# EAGLE design Ambiente_inferior (EAGLE 7.6.0)
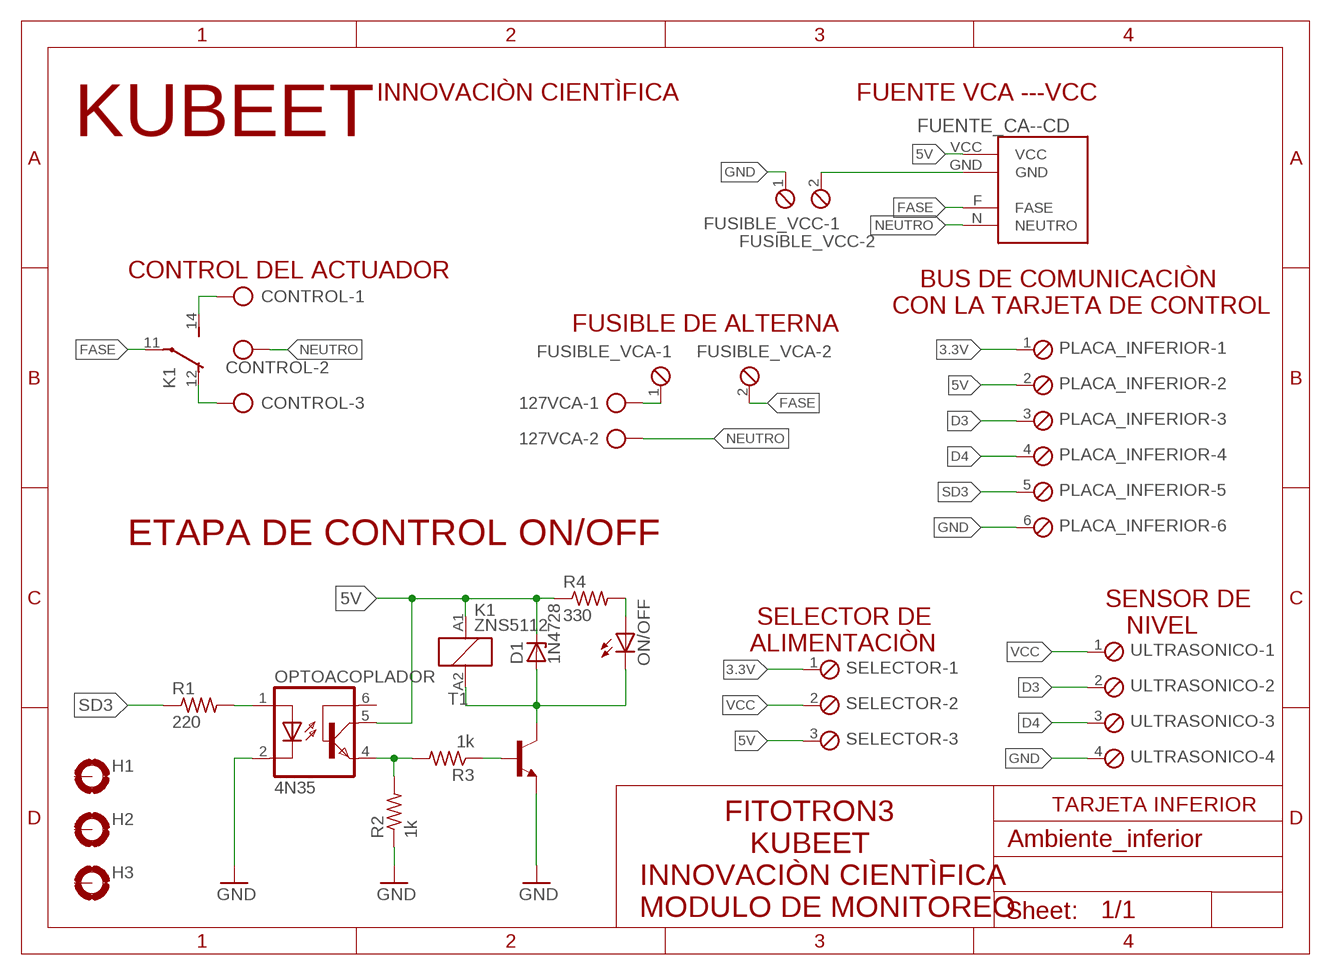
[diagram p0: schematic, sheet 1]

## Parts
127VCA  AK300/2  [AK300/2]
CONTROL  AK300/3  [AK300/3]
D1  1N4728  [DO41Z10]
FUENTE_CA--CD  MINI-FUENTE  [MINI-FUENTE]
FUSIBLE_VCA  MPT2  [2POL254]
FUSIBLE_VCC  MPT2  [2POL254]
H1  MOUNT-PAD-ROUND3.6  [3,6-PAD]
H2  MOUNT-PAD-ROUND3.6  [3,6-PAD]
H3  MOUNT-PAD-ROUND3.6  [3,6-PAD]
K1  ZNS5112  [ZN5]
ON/OFF  LED5MM  [LED5MM]
OPTOACOPLADOR  4N35  4N25M  [DIL06]
PLACA_INFERIOR  MPT6  [6POL254]
R1  220  R-US_0207/7  [0207/7]
R2  1k  R-US_0207/7  [0207/7]
R3  1k  R-US_0207/7  [0207/7]
R4  330  R-US_0207/7  [0207/7]
SELECTOR  MPT3  [3POL254]
T1  2N2222-NPN-TO92-EBC  [TO92-EBC]
ULTRASONICO  MPT4  [4POL254]

## Nets
3.3V: PLACA_INFERIOR.1 SELECTOR.1
5V: D1.C FUENTE_CA--CD.VCC K1.A1 OPTOACOPLADOR.5(COL) PLACA_INFERIOR.2 R4.1 SELECTOR.3
D3: PLACA_INFERIOR.3 ULTRASONICO.2
D4: PLACA_INFERIOR.4 ULTRASONICO.3
FASE: FUENTE_CA--CD.F(FASE) FUSIBLE_VCA.2 K1.11(2:P)
GND: FUSIBLE_VCC.1 OPTOACOPLADOR.2(C) PLACA_INFERIOR.6 R2.1 T1.E ULTRASONICO.4
N$142: OPTOACOPLADOR.1(A) R1.2
N$150: D1.A K1.A2 ON/OFF.K(C) T1.C
N$151: OPTOACOPLADOR.4(EMI) R2.2 R3.2
N$152: CONTROL.1 K1.14(2:S)
N$153: CONTROL.3 K1.12(2:O)
N$154: 127VCA.1 FUSIBLE_VCA.1
N$155: R3.1 T1.B
N$156: ON/OFF.A R4.2
N$166: FUENTE_CA--CD.GND FUSIBLE_VCC.2
NEUTRO: 127VCA.2 CONTROL.2 FUENTE_CA--CD.N(NEUTRO)
SD3: PLACA_INFERIOR.5 R1.1
VCC: SELECTOR.2 ULTRASONICO.1
Unconnected: H1.B3,6(MOUNT) H2.B3,6(MOUNT) H3.B3,6(MOUNT) OPTOACOPLADOR.6(BAS)

## Notes on the sheet
- INNOVACIÒN CIENTÌFICA | FUENTE VCA ---VCC
- KUBEET
- CONTROL DEL ACTUADOR
- BUS DE COMUNICACIÒN 
  CON LA TARJETA DE CONTROL
- FUSIBLE DE ALTERNA
- ETAPA DE CONTROL ON/OFF
- SENSOR DE
     NIVEL
- SELECTOR DE
  ALIMENTACIÒN
- TARJETA INFERIOR
- FITOTRON3
               KUBEET 
  INNOVACIÒN CIENTÌFICA
  MODULO DE MONITOREO

## Library data of the parts
127VCA = con-ptr500:AK300/2: CONNECTOR; OC_FARNELL: unknown; OC_NEWARK: unknown
CONTROL = con-ptr500:AK300/3: CONNECTOR; OC_FARNELL: unknown; OC_NEWARK: unknown
D1 = diode:1N4728: Z DIODE 3.3 V, 1W, 5 percent
FUENTE_CA--CD = CONECTORES RODAS:MINI-FUENTE
FUSIBLE_VCA FUSIBLE_VCC = con-phoenix-254:MPT2: PHOENIX CONNECTOR; OC_FARNELL: unknown; OC_NEWARK: unknown
H1-H3 = holes:MOUNT-PAD-ROUND: MOUNTING PAD, round
K1 = relay:ZNS5*: Miniature Power PCB Relay SCHRACK 1pole 10 A Source: http://www.schrack.com/.. 5847.pdf; OC_FARNELL: unknown; OC_NEWARK: unknown
ON/OFF = led:LED: LED OSRAM: - CHIPLED LG R971, LG N971, LY N971, LG Q971, LY Q971, LO R971, LY R971 LH N974, LH R974 LS Q976, LO Q976, LY Q976 LO Q996 - Hyper CHIPLED LW Q18S LB Q993, LB Q99A, LB R99A - SideLED LS A670, LO A670, LY A670, LG A670, LP A670 LB A673, LV A673, LT A673, LW A673 LH A674 LY A675 LS A676, LA A676, LO A676, LY A676, LW A676 LS A679, LY A679, LG A679 - Hyper Micro SIDELED® LS Y876, LA Y876, LO Y876, LY Y876 LT Y87S - SmartLED LW L88C, LW L88S LB L89C, LB L89S, LG L890 LS L89K, LO L89K, LY L89K LS L896, LA L896, LO L896, LY L896 - TOPLED LS T670, LO T670, LY T670, LG T670, LP T670 LSG T670, LSP T670, LSY T670, LOP T670, LYG T670 LG T671, LOG T671, LSG T671 LB T673, LV T673, LT T673, LW T673 LH T674 LS T676, LA T676, LO T676, LY T676, LB T676, LH T676, LSB T676, LW T676 LB T67C, LV T67C, LT T67C, LS T67K, LO T67K, LY T67K, LW E67C LS E67B, LA E67B, LO E67B, LY E67B, LB E67C, LV E67C, LT E67C LW T67C LS T679, LY T679, LG T679 LS T770, LO T770, LY T770, LG T770, LP T770 LB T773, LV T773, LT T773, LW T773 LH T774 LS E675, LA E675, LY E675, LS T675 LS T776, LA T776, LO T776, LY T776, LB T776 LHGB T686 LT T68C, LB T68C - Hyper Mini TOPLED® LB M676 - Mini TOPLED Santana® LG M470 LS M47K, LO M47K, LY M47K Source: http://www.osram.convergy.de LUXEON: - LUMILED® LXK2-PW12-R00, LXK2-PW12-S00, LXK2-PW14-U00, LXK2-PW14-V00 LXK2-PM12-R00, LXK2-PM12-S00, LXK2-PM14-U00 LXK2-PE12-Q00, LXK2-PE12-R00, LXK2-PE12-S00, LXK2-PE14-T00, LXK2-PE14-U00 LXK2-PB12-K00, LXK2-PB12-L00, LXK2-PB12-M00, LXK2-PB14-N00, LXK2-PB14-P00, LXK2-PB14-Q00 LXK2-PR12-L00, LXK2-PR12-M00, LXK2-PR14-Q00, LXK2-PR14-R00 LXK2-PD12-Q00, LXK2-PD12-R00, LXK2-PD12-S00 LXK2-PH12-R00, LXK2-PH12-S00 LXK2-PL12-P00, LXK2-PL12-Q00, LXK2-PL12-R00 Source: www.luxeon.com KINGBRIGHT: KA-3528ASYC Source: www.kingbright.com
OPTOACOPLADOR = optocoupler:4N*?M: General Purpose 6-Pin Phototransistor Optocouplers Source: http://www.fairchildsemi.com/ds/4N/4N35-M.pdf; MPN: 4N25-M; OC_FARNELL: 1021349; OC_NEWARK: 98K9084
PLACA_INFERIOR = con-phoenix-254:MPT6: PHOENIX CONNECTOR; OC_FARNELL: unknown; OC_NEWARK: unknown
R1-R4 = rcl:R-US_: RESISTOR, American symbol
SELECTOR = con-phoenix-254:MPT3: PHOENIX CONNECTOR; OC_FARNELL: unknown; OC_NEWARK: unknown
T1 = transistor-neu-to92:*-NPN-: NPN Transistror
ULTRASONICO = con-phoenix-254:MPT4: PHOENIX CONNECTOR; OC_FARNELL: unknown; OC_NEWARK: unknown

## Board
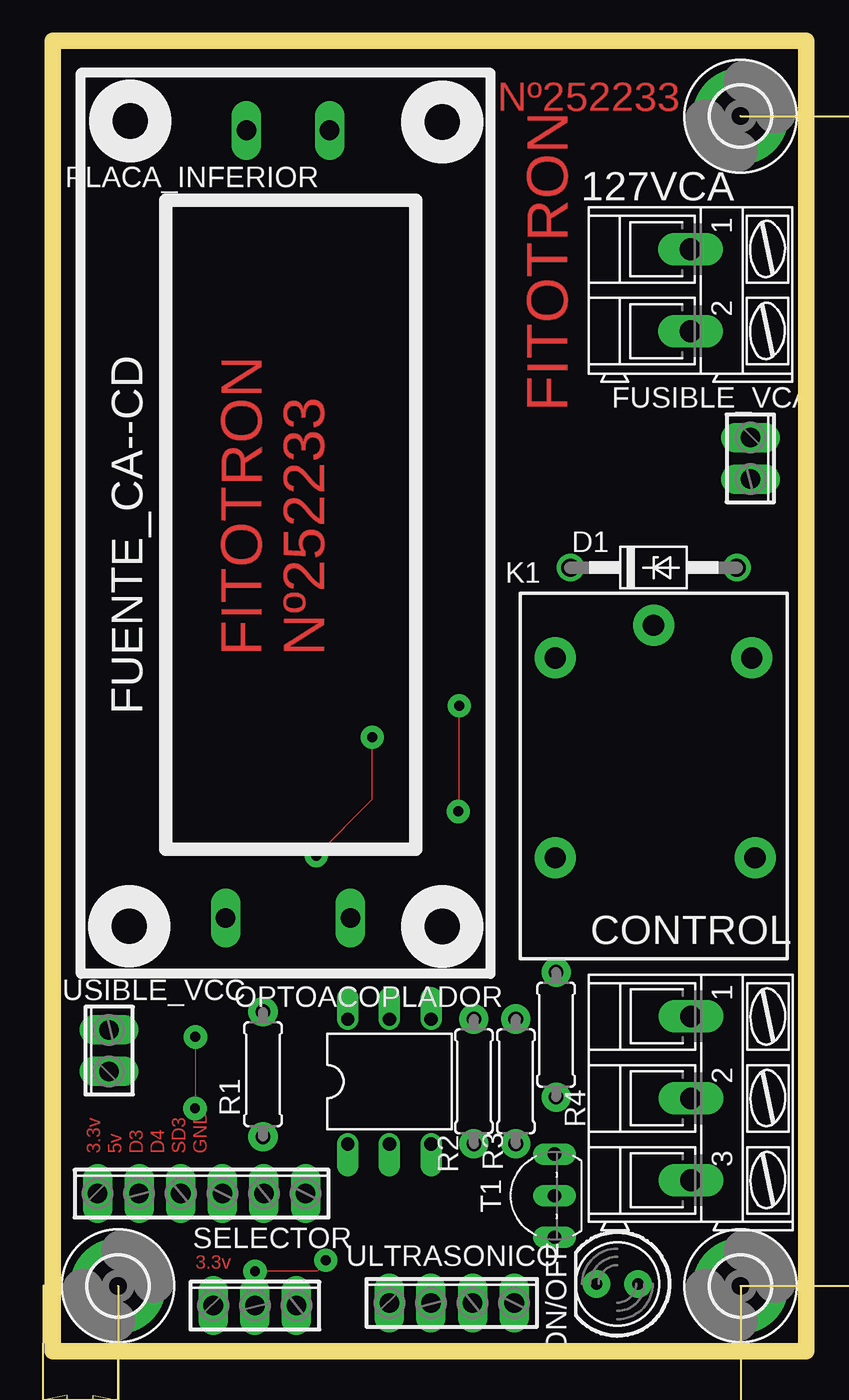
[diagram p1: board, top side]
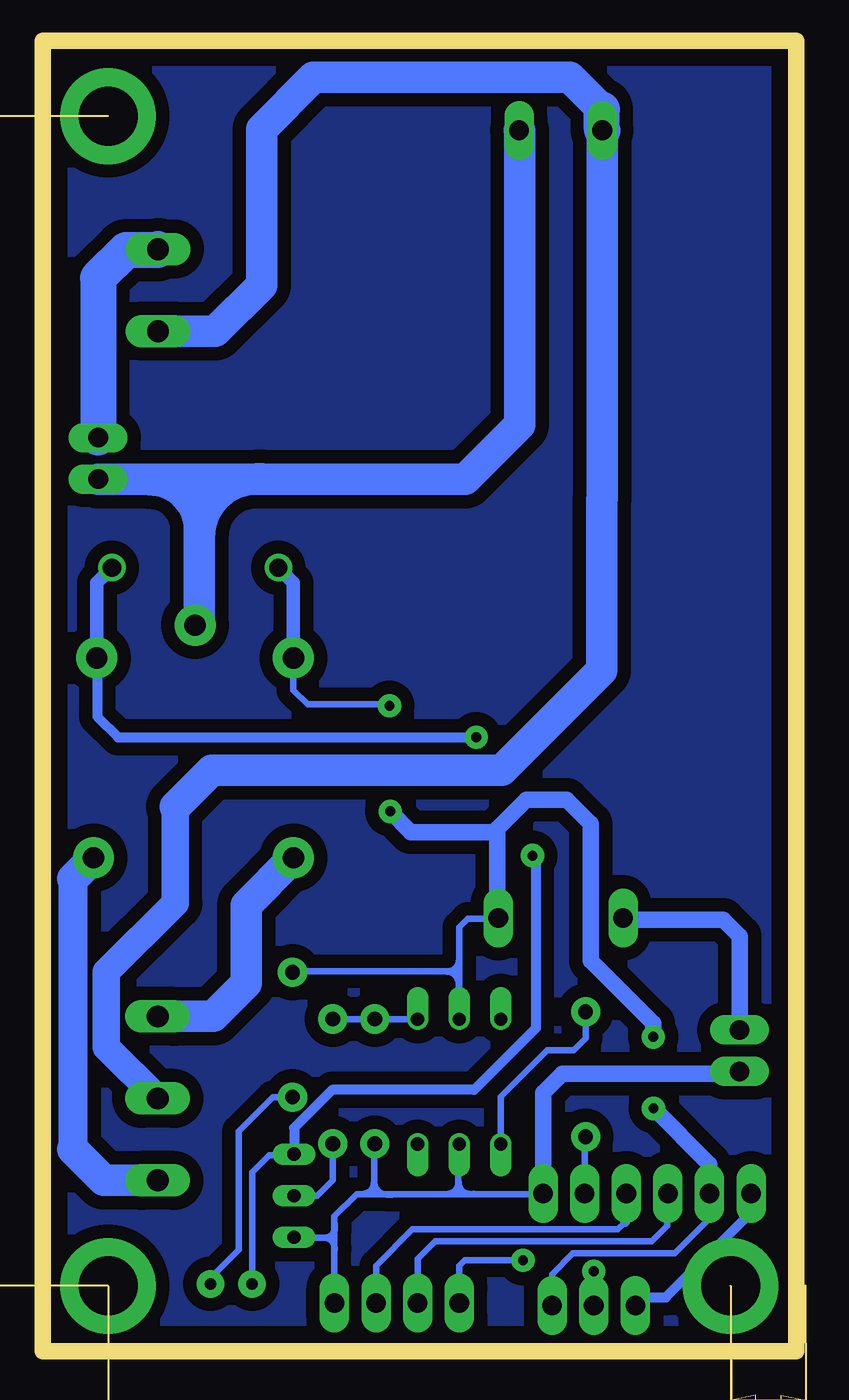
[diagram p2: board, bottom side, seen from below]

Size 46 x 80 mm. Coordinates in mm from the lower left corner, seen from the top.
Outline: 0,0 46,0 46,80 0,80 0,0
Copper layers (1*16): Top 0.035mm / dielectric 1.5mm / Bottom 0.035mm
Design rules "default": minimum track width 10mil, minimum drill 24mil, track to track 8mil, track to pad 8mil, pad to pad 8mil, via to via 8mil, smd to smd 8mil, copper to edge 40mil, drill to drill 8mil, minimum pad ring 10mil, minimum via ring 8mil, stop-mask expansion 4mil, vias tented up to drill 0mil, thermal gap 10mil
Milling: area 4,-6.8 to 5.5,-6.2; area 40.5,-6.8 to 42,-6.2; area 21.6,-6.1 to 24.4,-4.3; area 70.6,4 to 71.2,5.5; area 70.6,73.9 to 71.2,75.4; area 68.7,36.2 to 70.5,43.2; area 2.5,-3.3 to 4,-2.7; area -0.6,-3.3 to 0.9,-2.7; area -1.1,-5.2 to 4.5,-3.4; 9 lines

### Footprints (pad centres in the part's own frame; a part is rotated, then mirrored left to right if it is on the bottom)
AK300/2 = drill 1.321 long: 1 -2.515,0; 2 2.489,0
AK300/3 = drill 1.321 long: 1 -5.004,0; 2 0,0; 3 5.004,0
DO41Z10 = drill 1.118: A 5.08,0; C -5.08,0
MINI-FUENTE = drill 1.2 pad 1.778 long: F 51.5,9.825; GND 3.42,16.175; N 51.5,14.905; VCC 3.42,8.555
2POL254 = drill 1.2 long: 1 -1.27,0; 2 1.27,0
3,6-PAD = drill 3.6 pad 5.842: B3,6 0,0
ZN5 = drill 1.3 pad 2.5: 11 8.89,0; 12 -5.31,-6.2; 14 -5.31,6; A1 6.89,6; A2 6.89,-6
LED5MM = drill 0.7 pad 1.676: A -1.27,0; K 1.27,0
DIL06 = drill 0.813 offset: 1 -2.54,-3.81; 2 0,-3.81; 3 2.54,-3.81; 4 2.54,3.81; 5 0,3.81; 6 -2.54,3.81
6POL254 = drill 1.2 pad 1.778 long: 1 -6.35,0; 2 -3.81,0; 3 -1.27,0; 4 1.27,0; 5 3.81,0; 6 6.35,0
0207/7 = drill 0.9 pad 1.778: 1 -3.81,0; 2 3.81,0
3POL254 = drill 1.2 long: 1 -2.54,0; 2 0,0; 3 2.54,0
TO92-EBC = drill 0.813 long: B 0,-1.27; C 2.54,-1.27; E -2.54,-1.27
4POL254 = drill 1.2 long: 1 -3.81,0; 2 -1.27,0; 3 1.27,0; 4 3.81,0

### Placement (x,y rotation side)
127VCA  38.95,64.77 270 top
CONTROL  38.97,15.45 270 top
D1  36.69,47.84 0 top
FUENTE_CA--CD  26.74,23.04 90 top
FUSIBLE_VCA  42.6,54.52 270 top
FUSIBLE_VCC  3.45,18.36 90 top
H1  42,4 0 top
H2  4,4 0 top
H3  42,75.41 0 top
K1  36.69,35.45 90 top
ON/OFF  34.48,4.12 180 top
OPTOACOPLADOR  20.57,16.47 0 top
PLACA_INFERIOR  9.1,9.64 0 top
R1  12.85,16.92 90 top
R2  25.72,16.48 90 top
R3  28.29,16.48 90 top
R4  30.74,19.34 270 top
SELECTOR  12.35,2.8 0 top
T1  29.38,9.51 90 top
ULTRASONICO  24.37,2.96 0 top

### Tracks (layer width: path | path; a pad name or v marks a point on that pad's centre or on a via)
3.3V
  Bottom 0.61: PLACA_INFERIOR.1 2.75,8.51 7.95,3.3 9.31,3.3 SELECTOR.1
5V  (via drill 0.6 pad 1.42)
  Top 0: v24.77,32.97 24.82,33.02 v24.82,39.42 | v8.72,19.2 8.7,19.18 v8.7,14.84
  Bottom 0.406: 5.45,9.47 5.45,7.94 7.4,5.98 13.62,5.98 14.89,4.71 SELECTOR.3 | FUENTE_CA--CD.VCC 18.23,26.42 20.05,26.42 20.57,25.9 20.57,23.21 | 20.57,23.21 OPTOACOPLADOR.5 | R4.1 30.68,23.21 20.57,23.21 | v24.82,39.42 24.9,39.49 29.82,39.49 30.69,40.37 K1.A1
  Bottom 0.61: PLACA_INFERIOR.2 5.45,9.47 | FUENTE_CA--CD.VCC 18.38,26.66
  Bottom 0.813: D1.C 30.69,46.92 K1.A1
  Bottom 1.016: 18.38,26.66 18.24,26.79 18.24,31.71 | 18.24,31.71 18.24,31.91 16.48,33.66 14,33.66 12.54,32.2 12.54,23.86 8.72,20.04 v8.72,19.2 | v8.7,14.84 5.29,11.42 PLACA_INFERIOR.2 | v24.77,32.97 23.51,31.71 18.24,31.71
D3
  Bottom 0.406: 7.88,9.59 7.88,7.67 8.81,6.74 22.01,6.74 23.1,5.65 ULTRASONICO.2
  Bottom 0.61: PLACA_INFERIOR.3 7.88,9.59
D4
  Bottom 0.406: 10.44,7.9 10.88,7.45 23.42,7.45 25.64,5.23 ULTRASONICO.3
  Bottom 0.61: PLACA_INFERIOR.4 10.44,9.57 10.44,7.9
FASE
  Bottom 1.93: FUENTE_CA--CD.F 16.89,74.52 16.89,56.56 20.19,53.25 36.43,53.25 | 36.43,53.25 FUSIBLE_VCA.2 | K1.11 36.43,44.6 36.43,53.25
GND
  Bottom 0.406: PLACA_INFERIOR.6 15.49,9.6 20.61,9.6 | 20.61,9.6 25.77,9.6 | 25.77,9.6 26.83,9.6 28.18,8.25 28.18,6.93 | 28.18,6.93 ULTRASONICO.4 | OPTOACOPLADOR.2 20.61,12.62 20.61,9.6 | R2.1 25.77,12.63 25.77,9.6 | T1.E 30.61,6.93 28.18,6.93
  Bottom 1.016: FUSIBLE_VCC.1 3.61,16.94 14.29,16.94 15.45,15.78 PLACA_INFERIOR.6
N$110
  Bottom 0.61: 16.17,0.14 16.84,0.14
N$118
  pour Bottom (isolate 0.813): 1.03,0.62 46.28,-0.54 46.28,79.65 0.57,79.65 0.57,3.03
N$127  (1 unrouted)
  Bottom 0.61: -0.05,73.25 -0.05,72.35 | -0.1,70.46 -0.1,70.28
N$142
  Bottom 0.406: R1.2 12.87,20.72 12.83,20.68 12.83,19.13 13.57,18.39 15.18,18.39 18.03,15.54 OPTOACOPLADOR.1
N$150  (via drill 0.6 pad 1.42)
  Top 0: v16.09,30.27 19.52,33.7 v19.52,37.49
  Bottom 0.406: 30.69,12.09 T1.C 30.71,11.99 32.16,11.99 33.21,10.94 ON/OFF.K
  Bottom 0.61: K1.A2 42.65,42.29 42.65,38.75 41.39,37.49 v19.52,37.49 | T1.C 30.65,13.64 28.33,15.96 19.66,15.96 15.89,19.73 15.89,30.06 v16.09,30.27
  Bottom 0.813: D1.A 42.69,46.92 K1.A2
N$151
  Bottom 0.406: R3.2 R2.2 OPTOACOPLADOR.4
N$152
  Bottom 1.93: K1.14 33.58,27.25 33.58,22.47 35.6,20.45 CONTROL.1
N$153
  Bottom 1.778: 44.17,28.86 44.17,12.35
  Bottom 1.93: K1.12 44.17,28.86 | 44.17,12.35 42.27,10.45 CONTROL.3
N$154
  Bottom 2.184: 127VCA.1 39,67.23 40.91,67.23 42.6,65.54 FUSIBLE_VCA.1
N$155
  Bottom 0.406: T1.B 29.22,9.5 28.29,10.44 R3.1
N$156
  Bottom 0.406: R4.2 31.95,15.52 34.04,13.44 34.04,6.2 35.75,4.48 ON/OFF.A
N$157
  Bottom 0.406: 19.67,9.61 19.92,9.61 arc90 20.6,10.34 arc90 21.34,9.61 21.36,9.61
N$158
  Bottom 0.406: 24.69,9.58 24.96,9.58 arc90 25.77,10.38 25.77,10.33 arc90 26.49,9.6
N$159
  Bottom 0.406: 28.15,7.81 28.15,7.58 arc90 28.79,6.94 arc90 28.18,6.33 28.18,6.21
N$160
  Bottom 0.406: 20.57,24.39 20.57,23.87 arc90 21.36,23.2 arc90 20.6,22.43 20.6,22.22
N$161
  Bottom 1.93: 32.63,53.27 32.89,53.27 arc-90 36.43,49.73 36.43,50.19 arc-90 39.44,53.2
N$166
  Bottom 1.016: 3.5,19.58 FUSIBLE_VCC.2 3.45,25.35 4.44,26.34 10.44,26.34 FUENTE_CA--CD.GND
NEUTRO
  Bottom 1.676: CONTROL.2 42.1,18.58 42.1,23.16 37.9,27.37 37.9,33.26
  Bottom 1.93: FUENTE_CA--CD.N 11.83,52.05 11.85,52.03 11.85,41.58 17.96,35.47 35.69,35.47 37.9,33.26 | 11.86,75.82 13.81,77.77 29.48,77.77 32.63,74.62 32.63,65.1 35.45,62.28 127VCA.2
  Bottom 2.184: FUENTE_CA--CD.N 11.86,74.57 11.86,75.82
SD3
  Bottom 0.406: R1.1 12.91,13.05 PLACA_INFERIOR.5
VCC  (via drill 0.6 pad 1.42)
  Top 0: v16.67,5.57 16.18,4.89 v12.36,4.89
  Bottom 0.406: ULTRASONICO.1 20.55,2.97 20.55,5.24 20.23,5.57 v16.67,5.57 | v12.36,4.89 12.38,4.15 SELECTOR.2

### Text on the board
Top: Nº252233 | FITOTRON | FITOTRON / Nº252233 | 3.3v | 5v | D3 | D4 | SD3 | GND | 3.3v